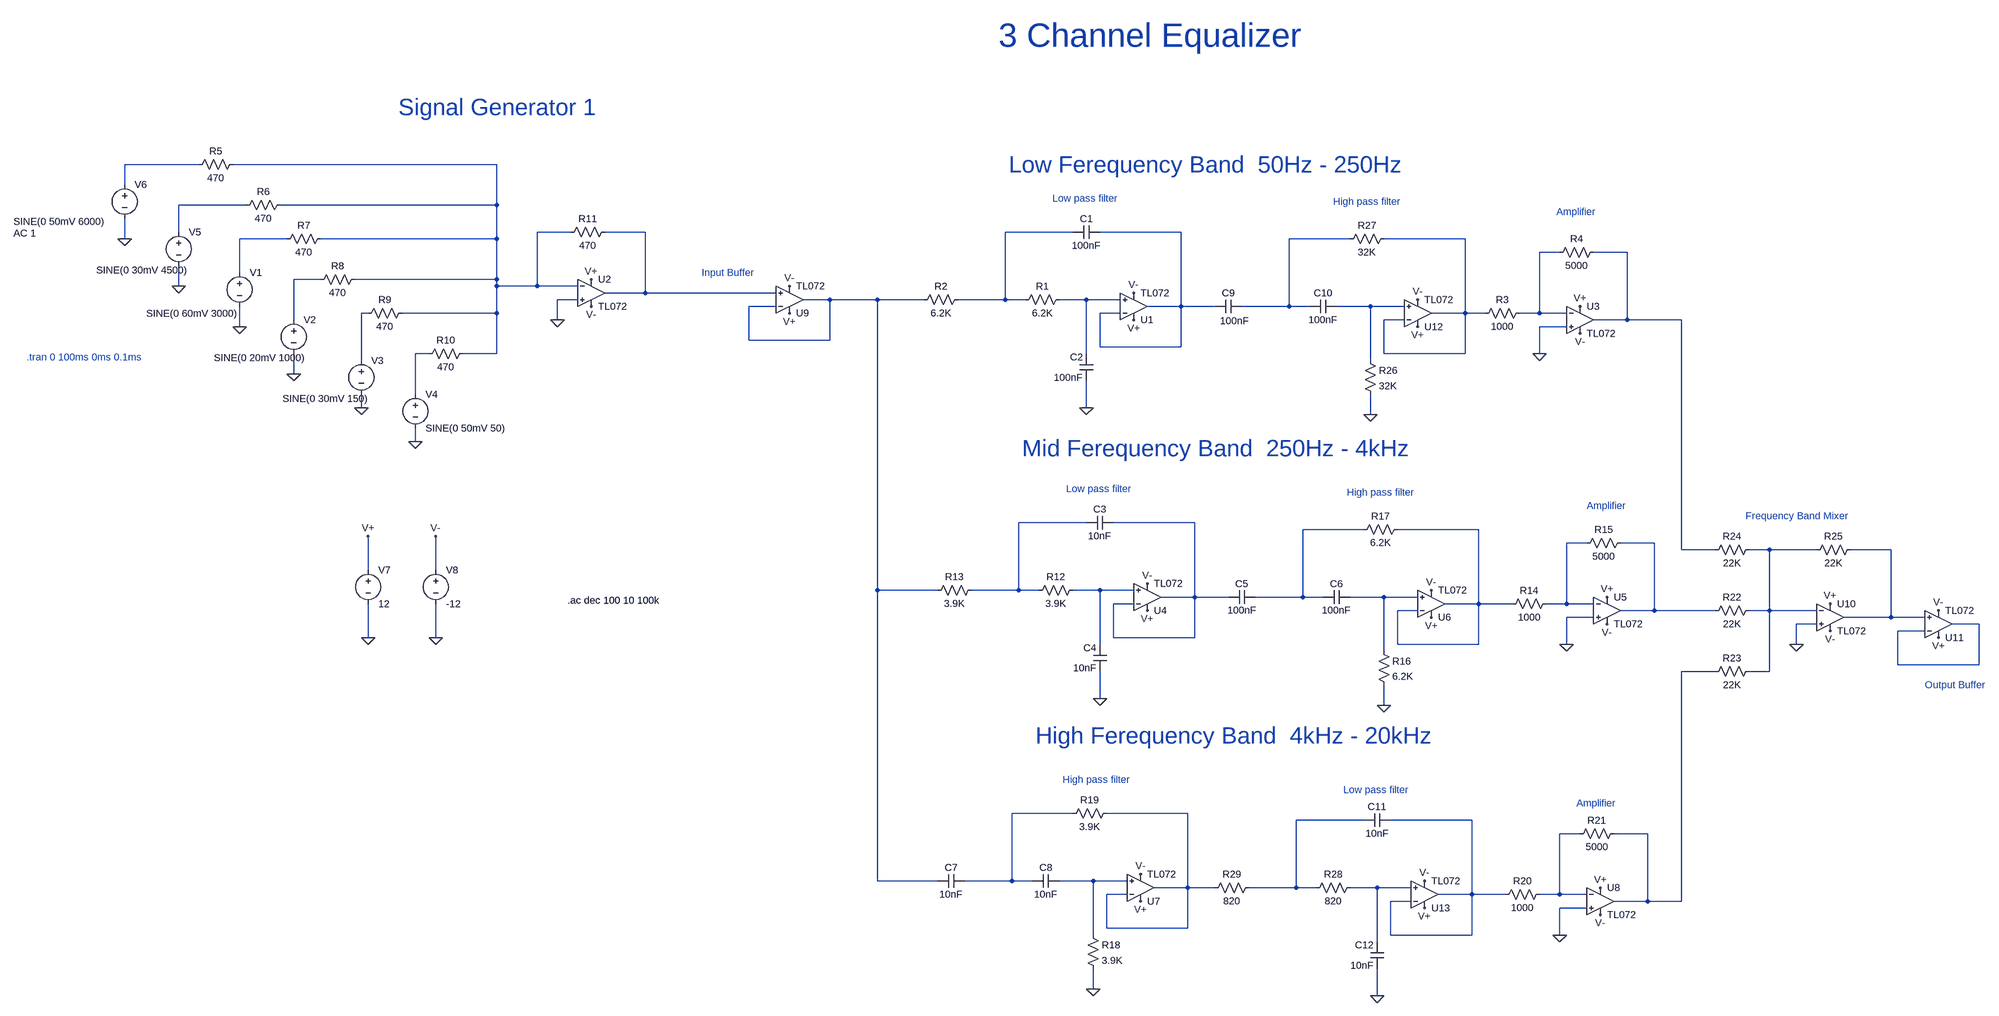
[diagram p0: schematic TL072_Equalizer_zelenkey.asc]
TL072_Equalizer_zelenkey.asc, the LTspice schematic file:
Version 4.1
SHEET 1 5140 2964
WIRE 336 576 160 576
WIRE 1040 576 416 576
WIRE 160 624 160 576
WIRE 448 672 288 672
WIRE 1040 672 1040 576
WIRE 1040 672 528 672
WIRE 288 736 288 672
WIRE 1216 736 1136 736
WIRE 1392 736 1296 736
WIRE 2512 736 2352 736
WIRE 2768 736 2576 736
WIRE 160 752 160 704
WIRE 544 752 432 752
WIRE 1040 752 1040 672
WIRE 1040 752 624 752
WIRE 3168 752 3024 752
WIRE 3440 752 3248 752
WIRE 3664 784 3616 784
WIRE 3824 784 3744 784
WIRE 432 832 432 752
WIRE 624 848 560 848
WIRE 1040 848 1040 752
WIRE 1040 848 704 848
WIRE 288 864 288 816
WIRE 1040 864 1040 848
WIRE 1136 864 1136 736
WIRE 1136 864 1040 864
WIRE 1232 864 1136 864
WIRE 1392 880 1392 736
WIRE 1392 880 1296 880
WIRE 1776 880 1392 880
WIRE 1232 896 1184 896
WIRE 1904 896 1840 896
WIRE 2016 896 1904 896
WIRE 2160 896 2016 896
WIRE 2352 896 2352 736
WIRE 2352 896 2240 896
WIRE 2400 896 2352 896
WIRE 2544 896 2480 896
WIRE 2624 896 2544 896
WIRE 1776 912 1712 912
WIRE 2768 912 2768 736
WIRE 2768 912 2688 912
WIRE 2848 912 2768 912
WIRE 3024 912 3024 752
WIRE 3024 912 2912 912
WIRE 3072 912 3024 912
WIRE 3216 912 3136 912
WIRE 3296 912 3216 912
WIRE 736 928 720 928
WIRE 1040 928 1040 864
WIRE 1040 928 816 928
WIRE 2624 928 2576 928
WIRE 3440 928 3440 752
WIRE 3440 928 3360 928
WIRE 3488 928 3440 928
WIRE 3616 928 3616 784
WIRE 3616 928 3568 928
WIRE 3680 928 3616 928
WIRE 560 944 560 848
WIRE 1184 944 1184 896
WIRE 3296 944 3248 944
WIRE 3824 944 3824 784
WIRE 3824 944 3744 944
WIRE 3952 944 3824 944
WIRE 432 960 432 912
WIRE 3680 960 3616 960
WIRE 1712 992 1712 912
WIRE 1904 992 1904 896
WIRE 1904 992 1712 992
WIRE 2576 1008 2576 928
WIRE 2768 1008 2768 912
WIRE 2768 1008 2576 1008
WIRE 880 1024 848 1024
WIRE 1040 1024 1040 928
WIRE 1040 1024 960 1024
WIRE 2544 1024 2544 896
WIRE 3248 1024 3248 944
WIRE 3440 1024 3440 928
WIRE 3440 1024 3248 1024
WIRE 3616 1024 3616 960
WIRE 720 1040 720 928
WIRE 3216 1040 3216 912
WIRE 560 1072 560 1024
WIRE 848 1120 848 1024
WIRE 720 1152 720 1120
WIRE 2544 1152 2544 1088
WIRE 3216 1168 3216 1120
WIRE 848 1232 848 1200
WIRE 2544 1424 2384 1424
WIRE 2800 1424 2608 1424
WIRE 3200 1440 3056 1440
WIRE 3472 1440 3280 1440
WIRE 3728 1472 3680 1472
WIRE 3888 1472 3808 1472
WIRE 3952 1488 3952 944
WIRE 4032 1488 3952 1488
WIRE 4160 1488 4112 1488
WIRE 4272 1488 4160 1488
WIRE 4448 1488 4352 1488
WIRE 736 1536 736 1456
WIRE 896 1536 896 1456
WIRE 2016 1584 2016 896
WIRE 2192 1584 2016 1584
WIRE 2384 1584 2384 1424
WIRE 2384 1584 2272 1584
WIRE 2432 1584 2384 1584
WIRE 2576 1584 2512 1584
WIRE 2656 1584 2576 1584
WIRE 2800 1600 2800 1424
WIRE 2800 1600 2720 1600
WIRE 2880 1600 2800 1600
WIRE 3056 1600 3056 1440
WIRE 3056 1600 2944 1600
WIRE 3104 1600 3056 1600
WIRE 3248 1600 3168 1600
WIRE 3328 1600 3248 1600
WIRE 2656 1616 2608 1616
WIRE 3472 1616 3472 1440
WIRE 3472 1616 3392 1616
WIRE 3552 1616 3472 1616
WIRE 3680 1616 3680 1472
WIRE 3680 1616 3632 1616
WIRE 3744 1616 3680 1616
WIRE 3328 1632 3280 1632
WIRE 3888 1632 3888 1472
WIRE 3888 1632 3808 1632
WIRE 4032 1632 3888 1632
WIRE 4160 1632 4160 1488
WIRE 4160 1632 4112 1632
WIRE 4272 1632 4160 1632
WIRE 3744 1648 3680 1648
WIRE 4448 1648 4448 1488
WIRE 4448 1648 4336 1648
WIRE 4528 1648 4448 1648
WIRE 4272 1664 4224 1664
WIRE 4656 1664 4592 1664
WIRE 4528 1680 4464 1680
WIRE 736 1696 736 1616
WIRE 896 1696 896 1616
WIRE 2608 1696 2608 1616
WIRE 2800 1696 2800 1600
WIRE 2800 1696 2608 1696
WIRE 2576 1712 2576 1584
WIRE 3280 1712 3280 1632
WIRE 3472 1712 3472 1616
WIRE 3472 1712 3280 1712
WIRE 3680 1712 3680 1648
WIRE 4224 1712 4224 1664
WIRE 3248 1728 3248 1600
WIRE 4464 1760 4464 1680
WIRE 4656 1760 4656 1664
WIRE 4656 1760 4464 1760
WIRE 4032 1776 3952 1776
WIRE 4160 1776 4160 1632
WIRE 4160 1776 4112 1776
WIRE 2576 1840 2576 1776
WIRE 3248 1856 3248 1808
WIRE 2512 2112 2368 2112
WIRE 2784 2112 2592 2112
WIRE 3200 2128 3040 2128
WIRE 3456 2128 3264 2128
WIRE 3712 2160 3664 2160
WIRE 3872 2160 3792 2160
WIRE 2016 2272 2016 1584
WIRE 2192 2272 2016 2272
WIRE 2368 2272 2368 2112
WIRE 2368 2272 2256 2272
WIRE 2416 2272 2368 2272
WIRE 2560 2272 2480 2272
WIRE 2640 2272 2560 2272
WIRE 2784 2288 2784 2112
WIRE 2784 2288 2704 2288
WIRE 2848 2288 2784 2288
WIRE 3040 2288 3040 2128
WIRE 3040 2288 2928 2288
WIRE 3088 2288 3040 2288
WIRE 3232 2288 3168 2288
WIRE 3312 2288 3232 2288
WIRE 2640 2304 2592 2304
WIRE 3456 2304 3456 2128
WIRE 3456 2304 3376 2304
WIRE 3536 2304 3456 2304
WIRE 3664 2304 3664 2160
WIRE 3664 2304 3616 2304
WIRE 3728 2304 3664 2304
WIRE 3312 2320 3264 2320
WIRE 3872 2320 3872 2160
WIRE 3872 2320 3792 2320
WIRE 3952 2320 3952 1776
WIRE 3952 2320 3872 2320
WIRE 3728 2336 3664 2336
WIRE 2592 2384 2592 2304
WIRE 2784 2384 2784 2288
WIRE 2784 2384 2592 2384
WIRE 2560 2400 2560 2272
WIRE 3264 2400 3264 2320
WIRE 3456 2400 3456 2304
WIRE 3456 2400 3264 2400
WIRE 3664 2400 3664 2336
WIRE 3232 2416 3232 2288
WIRE 2560 2528 2560 2480
WIRE 3232 2544 3232 2480
FLAG 2544 1152 0
FLAG 3616 1024 0
FLAG 848 1232 0
FLAG 720 1152 0
FLAG 560 1072 0
FLAG 432 960 0
FLAG 288 864 0
FLAG 160 752 0
FLAG 1184 944 0
FLAG 2576 1840 0
FLAG 3680 1712 0
FLAG 3248 1856 0
FLAG 2560 2528 0
FLAG 3664 2400 0
FLAG 4224 1712 0
FLAG 736 1696 0
FLAG 896 1696 0
FLAG 736 1456 V+
FLAG 1264 848 V+
FLAG 1808 928 V+
FLAG 2656 944 V+
FLAG 3712 912 V+
FLAG 2688 1632 V+
FLAG 3360 1648 V+
FLAG 3776 1600 V+
FLAG 4304 1616 V+
FLAG 4560 1696 V+
FLAG 2672 2320 V+
FLAG 3760 2288 V+
FLAG 896 1456 V-
FLAG 1264 912 V-
FLAG 1808 864 V-
FLAG 2656 880 V-
FLAG 3712 976 V-
FLAG 2688 1568 V-
FLAG 3360 1584 V-
FLAG 3776 1664 V-
FLAG 4304 1680 V-
FLAG 4560 1632 V-
FLAG 2672 2256 V-
FLAG 3760 2352 V-
FLAG 3216 1168 0
FLAG 3328 960 V+
FLAG 3328 896 V-
FLAG 3232 2544 0
FLAG 3344 2336 V+
FLAG 3344 2272 V-
SYMBOL res 2384 912 R270
WINDOW 0 32 56 VTop 2
WINDOW 3 0 56 VBottom 2
SYMATTR InstName R1
SYMATTR Value 6.2K
SYMBOL res 2144 912 R270
WINDOW 0 32 56 VTop 2
WINDOW 3 0 56 VBottom 2
SYMATTR InstName R2
SYMATTR Value 6.2K
SYMBOL cap 2576 720 R90
WINDOW 0 0 32 VBottom 2
WINDOW 3 32 32 VTop 2
SYMATTR InstName C1
SYMATTR Value 100nF
SYMBOL cap 2560 1088 R180
WINDOW 0 24 56 Left 2
WINDOW 3 24 8 Left 2
SYMATTR InstName C2
SYMATTR Value 100nF
SYMBOL res 3584 912 R90
WINDOW 0 0 56 VBottom 2
WINDOW 3 32 56 VTop 2
SYMATTR InstName R3
SYMATTR Value 1000
SYMBOL res 3760 768 R90
WINDOW 0 0 56 VBottom 2
WINDOW 3 32 56 VTop 2
SYMATTR InstName R4
SYMATTR Value 5000
SYMBOL voltage 432 816 R0
WINDOW 3 -221 113 Left 2
WINDOW 123 0 0 Left 0
WINDOW 39 0 0 Left 0
SYMATTR Value SINE(0 60mV 3000)
SYMATTR InstName V1
SYMBOL voltage 560 928 R0
WINDOW 3 -189 106 Left 2
WINDOW 123 0 0 Left 0
WINDOW 39 0 0 Left 0
SYMATTR Value SINE(0 20mV 1000)
SYMATTR InstName V2
SYMBOL voltage 720 1024 R0
WINDOW 3 -186 106 Left 2
WINDOW 123 0 0 Left 0
WINDOW 39 0 0 Left 0
SYMATTR Value SINE(0 30mV 150)
SYMATTR InstName V3
SYMBOL voltage 848 1104 R0
WINDOW 123 0 0 Left 0
WINDOW 39 0 0 Left 0
SYMATTR InstName V4
SYMATTR Value SINE(0 50mV 50)
SYMBOL voltage 288 720 R0
WINDOW 3 -195 106 Left 2
WINDOW 123 0 0 Left 0
WINDOW 39 0 0 Left 0
SYMATTR Value SINE(0 30mV 4500)
SYMATTR InstName V5
SYMBOL voltage 160 608 R0
WINDOW 3 -263 103 Left 2
WINDOW 123 -263 131 Left 2
WINDOW 39 0 0 Left 0
SYMATTR Value SINE(0 50mV 6000)
SYMATTR Value2 AC 1
SYMATTR InstName V6
SYMBOL res 432 560 R90
WINDOW 0 0 56 VBottom 2
WINDOW 3 32 56 VTop 2
SYMATTR InstName R5
SYMATTR Value 470
SYMBOL res 544 656 R90
WINDOW 0 0 56 VBottom 2
WINDOW 3 32 56 VTop 2
SYMATTR InstName R6
SYMATTR Value 470
SYMBOL res 640 736 R90
WINDOW 0 0 56 VBottom 2
WINDOW 3 32 56 VTop 2
SYMATTR InstName R7
SYMATTR Value 470
SYMBOL res 720 832 R90
WINDOW 0 0 56 VBottom 2
WINDOW 3 32 56 VTop 2
SYMATTR InstName R8
SYMATTR Value 470
SYMBOL res 832 912 R90
WINDOW 0 0 56 VBottom 2
WINDOW 3 32 56 VTop 2
SYMATTR InstName R9
SYMATTR Value 470
SYMBOL res 976 1008 R90
WINDOW 0 0 56 VBottom 2
WINDOW 3 32 56 VTop 2
SYMATTR InstName R10
SYMATTR Value 470
SYMBOL res 1312 720 R90
WINDOW 0 0 56 VBottom 2
WINDOW 3 32 56 VTop 2
SYMATTR InstName R11
SYMATTR Value 470
SYMBOL res 2416 1600 R270
WINDOW 0 32 56 VTop 2
WINDOW 3 0 56 VBottom 2
SYMATTR InstName R12
SYMATTR Value 3.9K
SYMBOL res 2176 1600 R270
WINDOW 0 32 56 VTop 2
WINDOW 3 0 56 VBottom 2
SYMATTR InstName R13
SYMATTR Value 3.9K
SYMBOL cap 2608 1408 R90
WINDOW 0 0 32 VBottom 2
WINDOW 3 32 32 VTop 2
SYMATTR InstName C3
SYMATTR Value 10nF
SYMBOL cap 2592 1776 R180
WINDOW 0 24 56 Left 2
WINDOW 3 24 8 Left 2
SYMATTR InstName C4
SYMATTR Value 10nF
SYMBOL res 3648 1600 R90
WINDOW 0 0 56 VBottom 2
WINDOW 3 32 56 VTop 2
SYMATTR InstName R14
SYMATTR Value 1000
SYMBOL res 3824 1456 R90
WINDOW 0 0 56 VBottom 2
WINDOW 3 32 56 VTop 2
SYMATTR InstName R15
SYMATTR Value 5000
SYMBOL res 3232 1712 R0
SYMATTR InstName R16
SYMATTR Value 6.2K
SYMBOL res 3184 1456 R270
WINDOW 0 32 56 VTop 2
WINDOW 3 0 56 VBottom 2
SYMATTR InstName R17
SYMATTR Value 6.2K
SYMBOL cap 2944 1584 R90
WINDOW 0 0 32 VBottom 2
WINDOW 3 32 32 VTop 2
SYMATTR InstName C5
SYMATTR Value 100nF
SYMBOL cap 3104 1616 R270
WINDOW 0 32 32 VTop 2
WINDOW 3 0 32 VBottom 2
SYMATTR InstName C6
SYMATTR Value 100nF
SYMBOL res 2544 2384 R0
SYMATTR InstName R18
SYMATTR Value 3.9K
SYMBOL res 2496 2128 R270
WINDOW 0 32 56 VTop 2
WINDOW 3 0 56 VBottom 2
SYMATTR InstName R19
SYMATTR Value 3.9K
SYMBOL cap 2256 2256 R90
WINDOW 0 0 32 VBottom 2
WINDOW 3 32 32 VTop 2
SYMATTR InstName C7
SYMATTR Value 10nF
SYMBOL cap 2416 2288 R270
WINDOW 0 32 32 VTop 2
WINDOW 3 0 32 VBottom 2
SYMATTR InstName C8
SYMATTR Value 10nF
SYMBOL res 3632 2288 R90
WINDOW 0 0 56 VBottom 2
WINDOW 3 32 56 VTop 2
SYMATTR InstName R20
SYMATTR Value 1000
SYMBOL res 3808 2144 R90
WINDOW 0 0 56 VBottom 2
WINDOW 3 32 56 VTop 2
SYMATTR InstName R21
SYMATTR Value 5000
SYMBOL res 4128 1616 R90
WINDOW 0 0 56 VBottom 2
WINDOW 3 32 56 VTop 2
SYMATTR InstName R22
SYMATTR Value 22K
SYMBOL res 4128 1760 R90
WINDOW 0 0 56 VBottom 2
WINDOW 3 32 56 VTop 2
SYMATTR InstName R23
SYMATTR Value 22K
SYMBOL res 4128 1472 R90
WINDOW 0 0 56 VBottom 2
WINDOW 3 32 56 VTop 2
SYMATTR InstName R24
SYMATTR Value 22K
SYMBOL res 4368 1472 R90
WINDOW 0 0 56 VBottom 2
WINDOW 3 32 56 VTop 2
SYMATTR InstName R25
SYMATTR Value 22K
SYMBOL voltage 736 1520 R0
WINDOW 123 0 0 Left 0
WINDOW 39 0 0 Left 0
SYMATTR InstName V7
SYMATTR Value 12
SYMBOL voltage 896 1520 R0
WINDOW 123 0 0 Left 0
WINDOW 39 0 0 Left 0
SYMATTR InstName V8
SYMATTR Value -12
SYMBOL lib\\lib\\sym\\OpAmps\\TL072 1264 880 R0
SYMATTR InstName U2
SYMBOL lib\\lib\\sym\\OpAmps\\TL072 1808 896 M180
SYMATTR InstName U9
SYMBOL lib\\lib\\sym\\OpAmps\\TL072 2656 912 M180
SYMATTR InstName U1
SYMBOL lib\\lib\\sym\\OpAmps\\TL072 3712 944 R0
SYMATTR InstName U3
SYMBOL lib\\lib\\sym\\OpAmps\\TL072 2688 1600 M180
SYMATTR InstName U4
SYMBOL lib\\lib\\sym\\OpAmps\\TL072 3360 1616 M180
SYMATTR InstName U6
SYMBOL lib\\lib\\sym\\OpAmps\\TL072 3776 1632 R0
SYMATTR InstName U5
SYMBOL lib\\lib\\sym\\OpAmps\\TL072 4304 1648 R0
SYMATTR InstName U10
SYMBOL lib\\lib\\sym\\OpAmps\\TL072 4560 1664 M180
SYMATTR InstName U11
SYMBOL lib\\lib\\sym\\OpAmps\\TL072 2672 2288 M180
SYMATTR InstName U7
SYMBOL lib\\lib\\sym\\OpAmps\\TL072 3760 2320 R0
SYMATTR InstName U8
SYMBOL res 3200 1024 R0
SYMATTR InstName R26
SYMATTR Value 32K
SYMBOL res 3152 768 R270
WINDOW 0 32 56 VTop 2
WINDOW 3 0 56 VBottom 2
SYMATTR InstName R27
SYMATTR Value 32K
SYMBOL cap 2912 896 R90
WINDOW 0 0 32 VBottom 2
WINDOW 3 35 17 VTop 2
SYMATTR InstName C9
SYMATTR Value 100nF
SYMBOL cap 3072 928 R270
WINDOW 0 32 32 VTop 2
WINDOW 3 0 32 VBottom 2
SYMATTR InstName C10
SYMATTR Value 100nF
SYMBOL lib\\lib\\sym\\OpAmps\\TL072 3328 928 M180
SYMATTR InstName U12
SYMBOL res 3072 2304 R270
WINDOW 0 32 56 VTop 2
WINDOW 3 0 56 VBottom 2
SYMATTR InstName R28
SYMATTR Value 820
SYMBOL res 2832 2304 R270
WINDOW 0 32 56 VTop 2
WINDOW 3 0 56 VBottom 2
SYMATTR InstName R29
SYMATTR Value 820
SYMBOL cap 3264 2112 R90
WINDOW 0 0 32 VBottom 2
WINDOW 3 32 32 VTop 2
SYMATTR InstName C11
SYMATTR Value 10nF
SYMBOL cap 3248 2480 R180
WINDOW 0 24 56 Left 2
WINDOW 3 24 8 Left 2
SYMATTR InstName C12
SYMATTR Value 10nF
SYMBOL lib\\lib\\sym\\OpAmps\\TL072 3344 2304 M180
SYMATTR InstName U13
TEXT -72 1032 Left 2 ;.tran 0 100ms 0ms 0.1ms
TEXT 808 440 Left 5 ;Signal Generator 1
TEXT 2464 656 Left 2 ;Low pass filter
TEXT 3656 688 Left 2 ;Amplifier
TEXT 2360 576 Left 5 ;Low Ferequency Band  50Hz - 250Hz
TEXT 2496 1344 Left 2 ;Low pass filter
TEXT 3728 1384 Left 2 ;Amplifier
TEXT 2392 1248 Left 5 ;Mid Ferequency Band  250Hz - 4kHz
TEXT 3160 1352 Left 2 ;High pass filter
TEXT 2488 2032 Left 2 ;High pass filter
TEXT 3704 2088 Left 2 ;Amplifier
TEXT 2424 1928 Left 5 ;High Ferequency Band  4kHz - 20kHz
TEXT 1600 832 Left 2 ;Input Buffer
TEXT 2336 264 Left 6 ;3 Channel Equalizer
TEXT 4528 1808 Left 2 ;Output Buffer
TEXT 4104 1408 Left 2 ;Frequency Band Mixer
TEXT 1208 1608 Left 2 !.ac dec 100 10 100k
TEXT 3128 664 Left 2 ;High pass filter
TEXT 3152 2056 Left 2 ;Low pass filter

The netlist it stands for:
* TL072_Equalizer_zelenkey.asc
R1 N005 N014 6.2K
R2 N013 N005 6.2K
C1 N006 N005 100nF
C2 0 N014 100nF
R3 N010 N009 1000
R4 N011 N010 5000
V1 N007 0 SINE(0 60mV 3000)
V2 N012 0 SINE(0 20mV 1000)
V3 N016 0 SINE(0 30mV 150)
V4 N017 0 SINE(0 50mV 50)
V5 N003 0 SINE(0 30mV 4500)
V6 N001 0 SINE(0 50mV 6000) AC 1
R5 N002 N001 470
R6 N002 N003 470
R7 N002 N007 470
R8 N002 N012 470
R9 N002 N016 470
R10 N002 N017 470
R11 N004 N002 470
R12 N018 N026 3.9K
R13 N013 N018 3.9K
C3 N019 N018 10nF
C4 0 N026 10nF
R14 N022 N021 1000
R15 N023 N022 5000
R16 N027 0 6.2K
R17 N020 N021 6.2K
C5 N020 N019 100nF
C6 N020 N027 100nF
R18 N035 0 3.9K
R19 N030 N031 3.9K
C7 N030 N013 10nF
C8 N030 N035 10nF
R20 N034 N033 1000
R21 N029 N034 5000
R22 N024 N023 22K
R23 N024 N029 22K
R24 N024 N011 22K
R25 N025 N024 22K
V7 V+ 0 12
V8 V- 0 -12
* U2: TL072 (symbol lib\lib\sym\OpAmps\TL072 not available, pins judged from their places): In+=0 In-=N002 V+=V+ V-=V- OUT=N004
* U9: TL072 (symbol lib\lib\sym\OpAmps\TL072 not available, pins judged from their places): In+=N004 In-=N013 V+=V+ V-=V- OUT=N013
* U1: TL072 (symbol lib\lib\sym\OpAmps\TL072 not available, pins judged from their places): In+=N014 In-=N006 V+=V+ V-=V- OUT=N006
* U3: TL072 (symbol lib\lib\sym\OpAmps\TL072 not available, pins judged from their places): In+=0 In-=N010 V+=V+ V-=V- OUT=N011
* U4: TL072 (symbol lib\lib\sym\OpAmps\TL072 not available, pins judged from their places): In+=N026 In-=N019 V+=V+ V-=V- OUT=N019
* U6: TL072 (symbol lib\lib\sym\OpAmps\TL072 not available, pins judged from their places): In+=N027 In-=N021 V+=V+ V-=V- OUT=N021
* U5: TL072 (symbol lib\lib\sym\OpAmps\TL072 not available, pins judged from their places): In+=0 In-=N022 V+=V+ V-=V- OUT=N023
* U10: TL072 (symbol lib\lib\sym\OpAmps\TL072 not available, pins judged from their places): In+=0 In-=N024 V+=V+ V-=V- OUT=N025
* U11: TL072 (symbol lib\lib\sym\OpAmps\TL072 not available, pins judged from their places): In+=N025 In-=N028 V+=V+ V-=V- OUT=N028
* U7: TL072 (symbol lib\lib\sym\OpAmps\TL072 not available, pins judged from their places): In+=N035 In-=N031 V+=V+ V-=V- OUT=N031
* U8: TL072 (symbol lib\lib\sym\OpAmps\TL072 not available, pins judged from their places): In+=0 In-=N034 V+=V+ V-=V- OUT=N029
R26 N015 0 32K
R27 N008 N009 32K
C9 N008 N006 100nF
C10 N008 N015 100nF
* U12: TL072 (symbol lib\lib\sym\OpAmps\TL072 not available, pins judged from their places): In+=N015 In-=N009 V+=V+ V-=V- OUT=N009
R28 N032 N036 820
R29 N031 N032 820
C11 N033 N032 10nF
C12 0 N036 10nF
* U13: TL072 (symbol lib\lib\sym\OpAmps\TL072 not available, pins judged from their places): In+=N036 In-=N033 V+=V+ V-=V- OUT=N033
* .tran 0 100ms 0ms 0.1ms
* Signal Generator 1
* Low pass filter
* Amplifier
* Low Ferequency Band  50Hz - 250Hz
* Low pass filter
* Amplifier
* Mid Ferequency Band  250Hz - 4kHz
* High pass filter
* High pass filter
* Amplifier
* High Ferequency Band  4kHz - 20kHz
* Input Buffer
* 3 Channel Equalizer
* Output Buffer
* Frequency Band Mixer
.ac dec 100 10 100k
* High pass filter
* Low pass filter
.backanno
.end